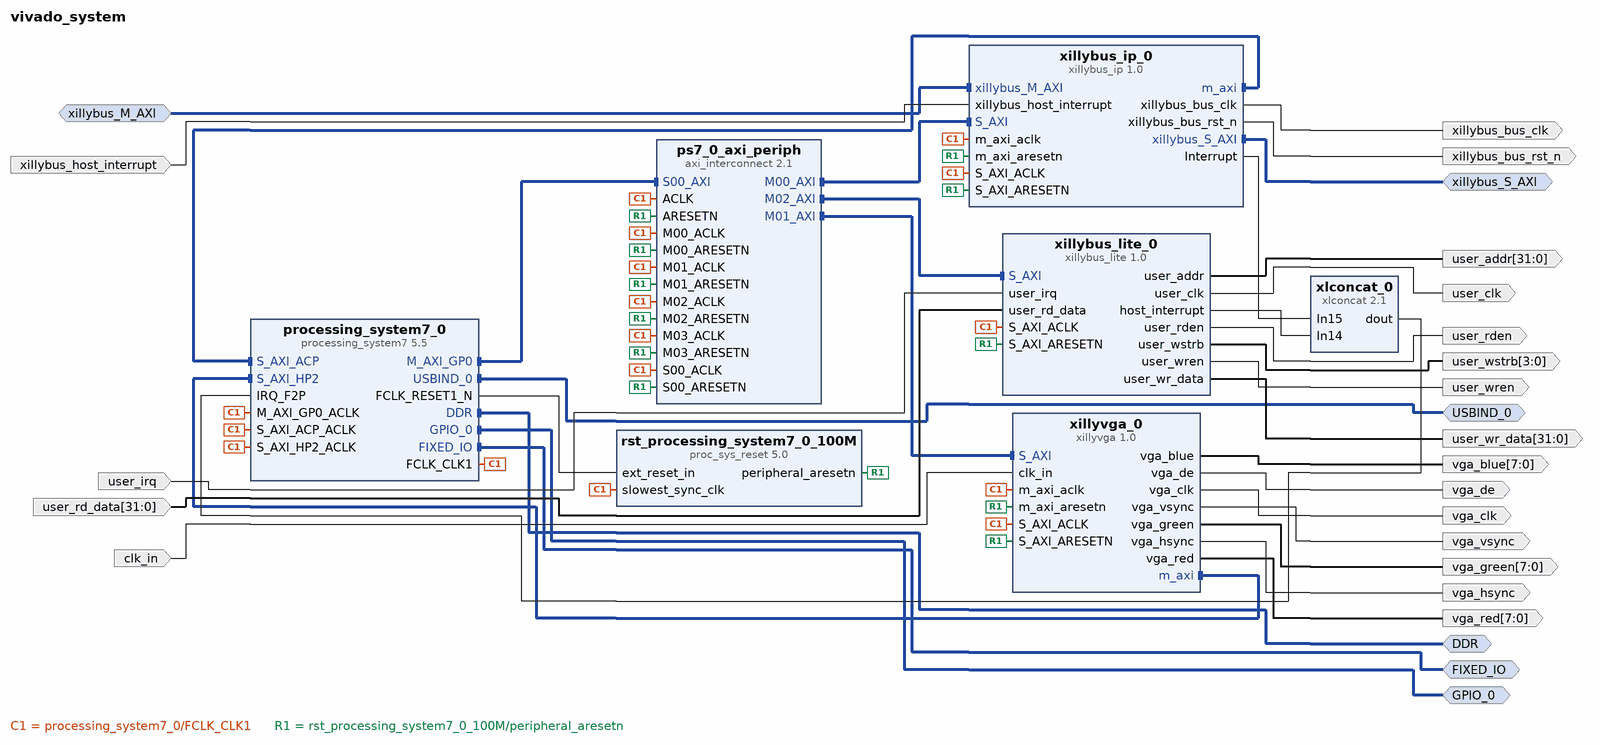
[diagram p0: block diagram of the top level]
# Vivado block design vivado_system, xc7z020clg484-1, Vivado 2018.3
create_bd_design vivado_system

create_bd_intf_port -mode Slave -vlnv xilinx.com:interface:aximm_rtl:1.0 xillybus_M_AXI
set_property -dict [list \
  CONFIG.ADDR_WIDTH 32 \
  CONFIG.ARUSER_WIDTH 0 \
  CONFIG.AWUSER_WIDTH 0 \
  CONFIG.BUSER_WIDTH 0 \
  CONFIG.DATA_WIDTH 64 \
  CONFIG.FREQ_HZ 100000000 \
  CONFIG.HAS_BRESP 1 \
  CONFIG.HAS_BURST 1 \
  CONFIG.HAS_CACHE 1 \
  CONFIG.HAS_LOCK 1 \
  CONFIG.HAS_PROT 1 \
  CONFIG.HAS_QOS 1 \
  CONFIG.HAS_REGION 1 \
  CONFIG.HAS_RRESP 1 \
  CONFIG.HAS_WSTRB 1 \
  CONFIG.ID_WIDTH 0 \
  CONFIG.MAX_BURST_LENGTH 16 \
  CONFIG.NUM_READ_OUTSTANDING 1 \
  CONFIG.NUM_READ_THREADS 1 \
  CONFIG.NUM_WRITE_OUTSTANDING 1 \
  CONFIG.NUM_WRITE_THREADS 1 \
  CONFIG.PHASE 0.000 \
  CONFIG.PROTOCOL AXI3 \
  CONFIG.READ_WRITE_MODE READ_WRITE \
  CONFIG.RUSER_BITS_PER_BYTE 0 \
  CONFIG.RUSER_WIDTH 0 \
  CONFIG.SUPPORTS_NARROW_BURST 1 \
  CONFIG.WUSER_BITS_PER_BYTE 0 \
  CONFIG.WUSER_WIDTH 0 \
] [get_bd_intf_ports xillybus_M_AXI]
create_bd_intf_port -mode Master -vlnv xilinx.com:interface:aximm_rtl:1.0 xillybus_S_AXI
set_property -dict {CONFIG.ADDR_WIDTH 32 CONFIG.DATA_WIDTH 32 CONFIG.PROTOCOL AXI4LITE} [get_bd_intf_ports xillybus_S_AXI]
create_bd_intf_port -mode Master -vlnv xilinx.com:interface:ddrx_rtl:1.0 DDR
create_bd_intf_port -mode Master -vlnv xilinx.com:display_processing_system7:fixedio_rtl:1.0 FIXED_IO
create_bd_intf_port -mode Master -vlnv xilinx.com:display_processing_system7:usbctrl_rtl:1.0 USBIND_0
create_bd_intf_port -mode Master -vlnv xilinx.com:interface:gpio_rtl:1.0 GPIO_0
create_bd_port -dir I xillybus_host_interrupt
create_bd_port -dir O xillybus_bus_rst_n
create_bd_port -dir O xillybus_bus_clk
create_bd_port -dir O vga_vsync
create_bd_port -dir O vga_de
create_bd_port -dir O -from 7 -to 0 vga_blue
create_bd_port -dir O -from 7 -to 0 vga_green
create_bd_port -dir O vga_clk
create_bd_port -dir O -from 7 -to 0 vga_red
create_bd_port -dir O vga_hsync
create_bd_port -dir I clk_in
create_bd_port -dir O -from 3 -to 0 user_wstrb
create_bd_port -dir O -from 31 -to 0 user_addr
create_bd_port -dir I user_irq
create_bd_port -dir O user_wren
create_bd_port -dir O user_clk
create_bd_port -dir O user_rden
create_bd_port -dir O -from 31 -to 0 user_wr_data
create_bd_port -dir I -from 31 -to 0 user_rd_data

create_bd_cell -type ip -vlnv xillybus:xillybus:xillybus_lite:1.0 xillybus_lite_0
create_bd_cell -type ip -vlnv xillybus:xillybus:xillybus_ip:1.0 xillybus_ip_0
create_bd_cell -type ip -vlnv xillybus:xillybus:xillyvga:1.0 xillyvga_0
create_bd_cell -type ip -vlnv xilinx.com:ip:processing_system7:5.5 processing_system7_0
set_property -dict [list \
  CONFIG.PCW_APU_PERIPHERAL_FREQMHZ 666.666667 \
  CONFIG.PCW_ENET0_ENET0_IO {MIO 16 .. 27} \
  CONFIG.PCW_ENET0_GRP_MDIO_ENABLE 1 \
  CONFIG.PCW_ENET0_GRP_MDIO_IO {MIO 52 .. 53} \
  CONFIG.PCW_ENET0_PERIPHERAL_ENABLE 1 \
  CONFIG.PCW_EN_CLK0_PORT 0 \
  CONFIG.PCW_EN_CLK1_PORT 1 \
  CONFIG.PCW_EN_RST0_PORT 0 \
  CONFIG.PCW_EN_RST1_PORT 1 \
  CONFIG.PCW_FCLK_CLK1_BUF TRUE \
  CONFIG.PCW_FPGA0_PERIPHERAL_FREQMHZ 100.000000 \
  CONFIG.PCW_FPGA1_PERIPHERAL_FREQMHZ 100.000000 \
  CONFIG.PCW_FPGA_FCLK1_ENABLE 1 \
  CONFIG.PCW_GPIO_EMIO_GPIO_ENABLE 1 \
  CONFIG.PCW_GPIO_EMIO_GPIO_IO 56 \
  CONFIG.PCW_GPIO_EMIO_GPIO_WIDTH 56 \
  CONFIG.PCW_GPIO_MIO_GPIO_ENABLE 0 \
  CONFIG.PCW_GPIO_PERIPHERAL_ENABLE 1 \
  CONFIG.PCW_IRQ_F2P_INTR 1 \
  CONFIG.PCW_PRESET_BANK1_VOLTAGE {LVCMOS 1.8V} \
  CONFIG.PCW_QSPI_GRP_SINGLE_SS_ENABLE 1 \
  CONFIG.PCW_QSPI_GRP_SINGLE_SS_IO {MIO 1 .. 6} \
  CONFIG.PCW_QSPI_PERIPHERAL_ENABLE 1 \
  CONFIG.PCW_QSPI_QSPI_IO {MIO 1 .. 6} \
  CONFIG.PCW_SD0_GRP_CD_ENABLE 1 \
  CONFIG.PCW_SD0_GRP_CD_IO {MIO 47} \
  CONFIG.PCW_SD0_GRP_WP_ENABLE 1 \
  CONFIG.PCW_SD0_GRP_WP_IO {MIO 46} \
  CONFIG.PCW_SD0_PERIPHERAL_ENABLE 1 \
  CONFIG.PCW_SD0_SD0_IO {MIO 40 .. 45} \
  CONFIG.PCW_SDIO_PERIPHERAL_FREQMHZ 50 \
  CONFIG.PCW_SINGLE_QSPI_DATA_MODE x4 \
  CONFIG.PCW_S_AXI_HP2_DATA_WIDTH 32 \
  CONFIG.PCW_UART1_PERIPHERAL_ENABLE 1 \
  CONFIG.PCW_UART1_UART1_IO {MIO 48 .. 49} \
  CONFIG.PCW_UART_PERIPHERAL_FREQMHZ 50 \
  CONFIG.PCW_UIPARAM_DDR_FREQ_MHZ 533.333313 \
  CONFIG.PCW_UIPARAM_DDR_PARTNO {MT41J128M16 HA-15E} \
  CONFIG.PCW_USB0_PERIPHERAL_ENABLE 1 \
  CONFIG.PCW_USB0_USB0_IO {MIO 28 .. 39} \
  CONFIG.PCW_USE_DEFAULT_ACP_USER_VAL 1 \
  CONFIG.PCW_USE_FABRIC_INTERRUPT 1 \
  CONFIG.PCW_USE_S_AXI_ACP 1 \
  CONFIG.PCW_USE_S_AXI_HP2 1 \
] [get_bd_cells processing_system7_0]
# 225 more settings of processing_system7_0 are not shown: defaults, MIO pin electricals, DDR timing, and values the tool derives
create_bd_cell -type ip -vlnv xilinx.com:ip:proc_sys_reset:5.0 rst_processing_system7_0_100M
create_bd_cell -type ip -vlnv xilinx.com:ip:xlconcat:2.1 xlconcat_0
set_property -dict {CONFIG.NUM_PORTS 16} [get_bd_cells xlconcat_0]
create_bd_cell -type ip -vlnv xilinx.com:ip:axi_interconnect:2.1 ps7_0_axi_periph
set_property -dict {CONFIG.NUM_MI 4} [get_bd_cells ps7_0_axi_periph]

# ---- connections ----

connect_bd_intf_net [get_bd_intf_ports USBIND_0] [get_bd_intf_pins processing_system7_0/USBIND_0]
connect_bd_intf_net [get_bd_intf_ports DDR] [get_bd_intf_pins processing_system7_0/DDR]
connect_bd_intf_net [get_bd_intf_pins processing_system7_0/M_AXI_GP0] [get_bd_intf_pins ps7_0_axi_periph/S00_AXI]
connect_bd_intf_net [get_bd_intf_pins ps7_0_axi_periph/M01_AXI] [get_bd_intf_pins xillyvga_0/S_AXI]
connect_bd_intf_net [get_bd_intf_pins ps7_0_axi_periph/M02_AXI] [get_bd_intf_pins xillybus_lite_0/S_AXI]
connect_bd_intf_net [get_bd_intf_ports GPIO_0] [get_bd_intf_pins processing_system7_0/GPIO_0]
connect_bd_intf_net [get_bd_intf_pins ps7_0_axi_periph/M00_AXI] [get_bd_intf_pins xillybus_ip_0/S_AXI]
connect_bd_intf_net [get_bd_intf_ports FIXED_IO] [get_bd_intf_pins processing_system7_0/FIXED_IO]
connect_bd_intf_net [get_bd_intf_ports xillybus_M_AXI] [get_bd_intf_pins xillybus_ip_0/xillybus_M_AXI]
connect_bd_intf_net [get_bd_intf_pins xillyvga_0/m_axi] [get_bd_intf_pins processing_system7_0/S_AXI_HP2]
connect_bd_intf_net [get_bd_intf_pins xillybus_ip_0/m_axi] [get_bd_intf_pins processing_system7_0/S_AXI_ACP]
connect_bd_intf_net [get_bd_intf_ports xillybus_S_AXI] [get_bd_intf_pins xillybus_ip_0/xillybus_S_AXI]
connect_bd_net [get_bd_pins processing_system7_0/FCLK_CLK1] \
  [get_bd_pins xillybus_lite_0/S_AXI_ACLK] [get_bd_pins xillyvga_0/m_axi_aclk] [get_bd_pins xillybus_ip_0/S_AXI_ACLK] \
  [get_bd_pins xillybus_ip_0/m_axi_aclk] [get_bd_pins xillyvga_0/S_AXI_ACLK] \
  [get_bd_pins processing_system7_0/M_AXI_GP0_ACLK] [get_bd_pins processing_system7_0/S_AXI_ACP_ACLK] \
  [get_bd_pins processing_system7_0/S_AXI_HP2_ACLK] [get_bd_pins rst_processing_system7_0_100M/slowest_sync_clk] \
  [get_bd_pins ps7_0_axi_periph/S00_ACLK] [get_bd_pins ps7_0_axi_periph/M00_ACLK] [get_bd_pins ps7_0_axi_periph/ACLK] \
  [get_bd_pins ps7_0_axi_periph/M01_ACLK] [get_bd_pins ps7_0_axi_periph/M02_ACLK] [get_bd_pins ps7_0_axi_periph/M03_ACLK]
connect_bd_net [get_bd_pins processing_system7_0/FCLK_RESET1_N] [get_bd_pins rst_processing_system7_0_100M/ext_reset_in]
connect_bd_net [get_bd_pins rst_processing_system7_0_100M/peripheral_aresetn] \
  [get_bd_pins xillybus_lite_0/S_AXI_ARESETN] [get_bd_pins xillyvga_0/m_axi_aresetn] \
  [get_bd_pins xillybus_ip_0/S_AXI_ARESETN] [get_bd_pins xillybus_ip_0/m_axi_aresetn] [get_bd_pins xillyvga_0/S_AXI_ARESETN] \
  [get_bd_pins ps7_0_axi_periph/S00_ARESETN] [get_bd_pins ps7_0_axi_periph/M00_ARESETN] \
  [get_bd_pins ps7_0_axi_periph/ARESETN] [get_bd_pins ps7_0_axi_periph/M01_ARESETN] \
  [get_bd_pins ps7_0_axi_periph/M02_ARESETN] [get_bd_pins ps7_0_axi_periph/M03_ARESETN]
connect_bd_net [get_bd_ports xillybus_host_interrupt] [get_bd_pins xillybus_ip_0/xillybus_host_interrupt]
connect_bd_net [get_bd_pins xillybus_ip_0/xillybus_bus_rst_n] [get_bd_ports xillybus_bus_rst_n]
connect_bd_net [get_bd_pins xillybus_ip_0/xillybus_bus_clk] [get_bd_ports xillybus_bus_clk]
connect_bd_net [get_bd_pins xlconcat_0/dout] [get_bd_pins processing_system7_0/IRQ_F2P]
connect_bd_net [get_bd_pins xillybus_ip_0/Interrupt] [get_bd_pins xlconcat_0/In15]
connect_bd_net [get_bd_pins xillybus_lite_0/host_interrupt] [get_bd_pins xlconcat_0/In14]
connect_bd_net [get_bd_pins xillyvga_0/vga_vsync] [get_bd_ports vga_vsync]
connect_bd_net [get_bd_pins xillyvga_0/vga_de] [get_bd_ports vga_de]
connect_bd_net [get_bd_pins xillyvga_0/vga_blue] [get_bd_ports vga_blue]
connect_bd_net [get_bd_pins xillyvga_0/vga_green] [get_bd_ports vga_green]
connect_bd_net [get_bd_pins xillyvga_0/vga_clk] [get_bd_ports vga_clk]
connect_bd_net [get_bd_pins xillyvga_0/vga_red] [get_bd_ports vga_red]
connect_bd_net [get_bd_pins xillyvga_0/vga_hsync] [get_bd_ports vga_hsync]
connect_bd_net [get_bd_ports clk_in] [get_bd_pins xillyvga_0/clk_in]
connect_bd_net [get_bd_pins xillybus_lite_0/user_wstrb] [get_bd_ports user_wstrb]
connect_bd_net [get_bd_pins xillybus_lite_0/user_addr] [get_bd_ports user_addr]
connect_bd_net [get_bd_ports user_irq] [get_bd_pins xillybus_lite_0/user_irq]
connect_bd_net [get_bd_pins xillybus_lite_0/user_wren] [get_bd_ports user_wren]
connect_bd_net [get_bd_pins xillybus_lite_0/user_clk] [get_bd_ports user_clk]
connect_bd_net [get_bd_pins xillybus_lite_0/user_rden] [get_bd_ports user_rden]
connect_bd_net [get_bd_pins xillybus_lite_0/user_wr_data] [get_bd_ports user_wr_data]
connect_bd_net [get_bd_ports user_rd_data] [get_bd_pins xillybus_lite_0/user_rd_data]

# ---- address map ----
assign_bd_address -offset 0x50000000 -range 4K -target_address_space [get_bd_addr_spaces processing_system7_0/Data] [get_bd_addr_segs xillybus_ip_0/S_AXI/reg0]
assign_bd_address -offset 0x50001000 -range 4K -target_address_space [get_bd_addr_spaces processing_system7_0/Data] [get_bd_addr_segs xillyvga_0/S_AXI/reg0]
assign_bd_address -offset 0x50002000 -range 4K -target_address_space [get_bd_addr_spaces processing_system7_0/Data] [get_bd_addr_segs xillybus_lite_0/S_AXI/reg0]
assign_bd_address -offset 0x00000000 -range 512M -target_address_space [get_bd_addr_spaces xillybus_ip_0/m_axi] [get_bd_addr_segs processing_system7_0/S_AXI_ACP/ACP_DDR_LOWOCM]
assign_bd_address -offset 0x00000000 -range 4G -target_address_space [get_bd_addr_spaces xillybus_M_AXI] [get_bd_addr_segs xillybus_ip_0/xillybus_M_AXI/reg0]
assign_bd_address -offset 0x00000000 -range 512M -target_address_space [get_bd_addr_spaces xillyvga_0/m_axi] [get_bd_addr_segs processing_system7_0/S_AXI_HP2/HP2_DDR_LOWOCM]

validate_bd_design
save_bd_design
